# Altium schematic sheet HandHeld_Terminal_V2_Rev2.SchDoc
size A1; SheetNumber: 1; SheetTotal: 1
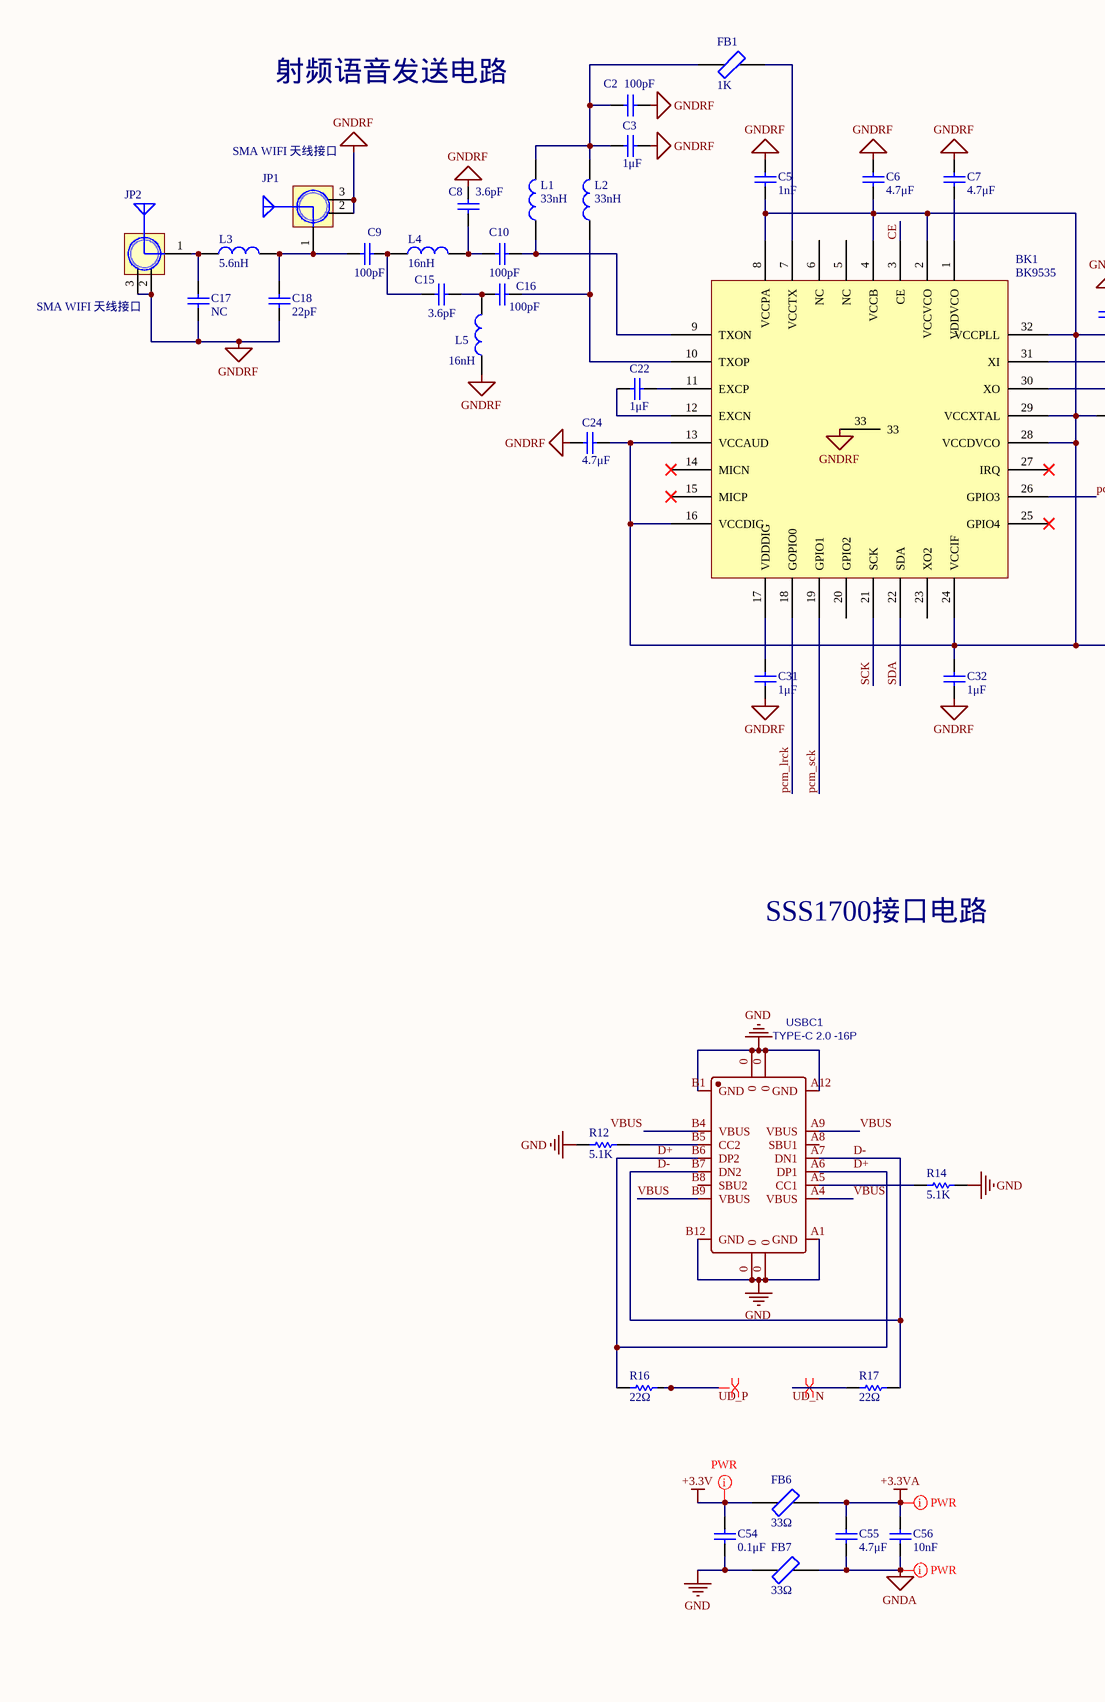
[diagram p0: HandHeld_Terminal_V2_Rev2.SchDoc, left]
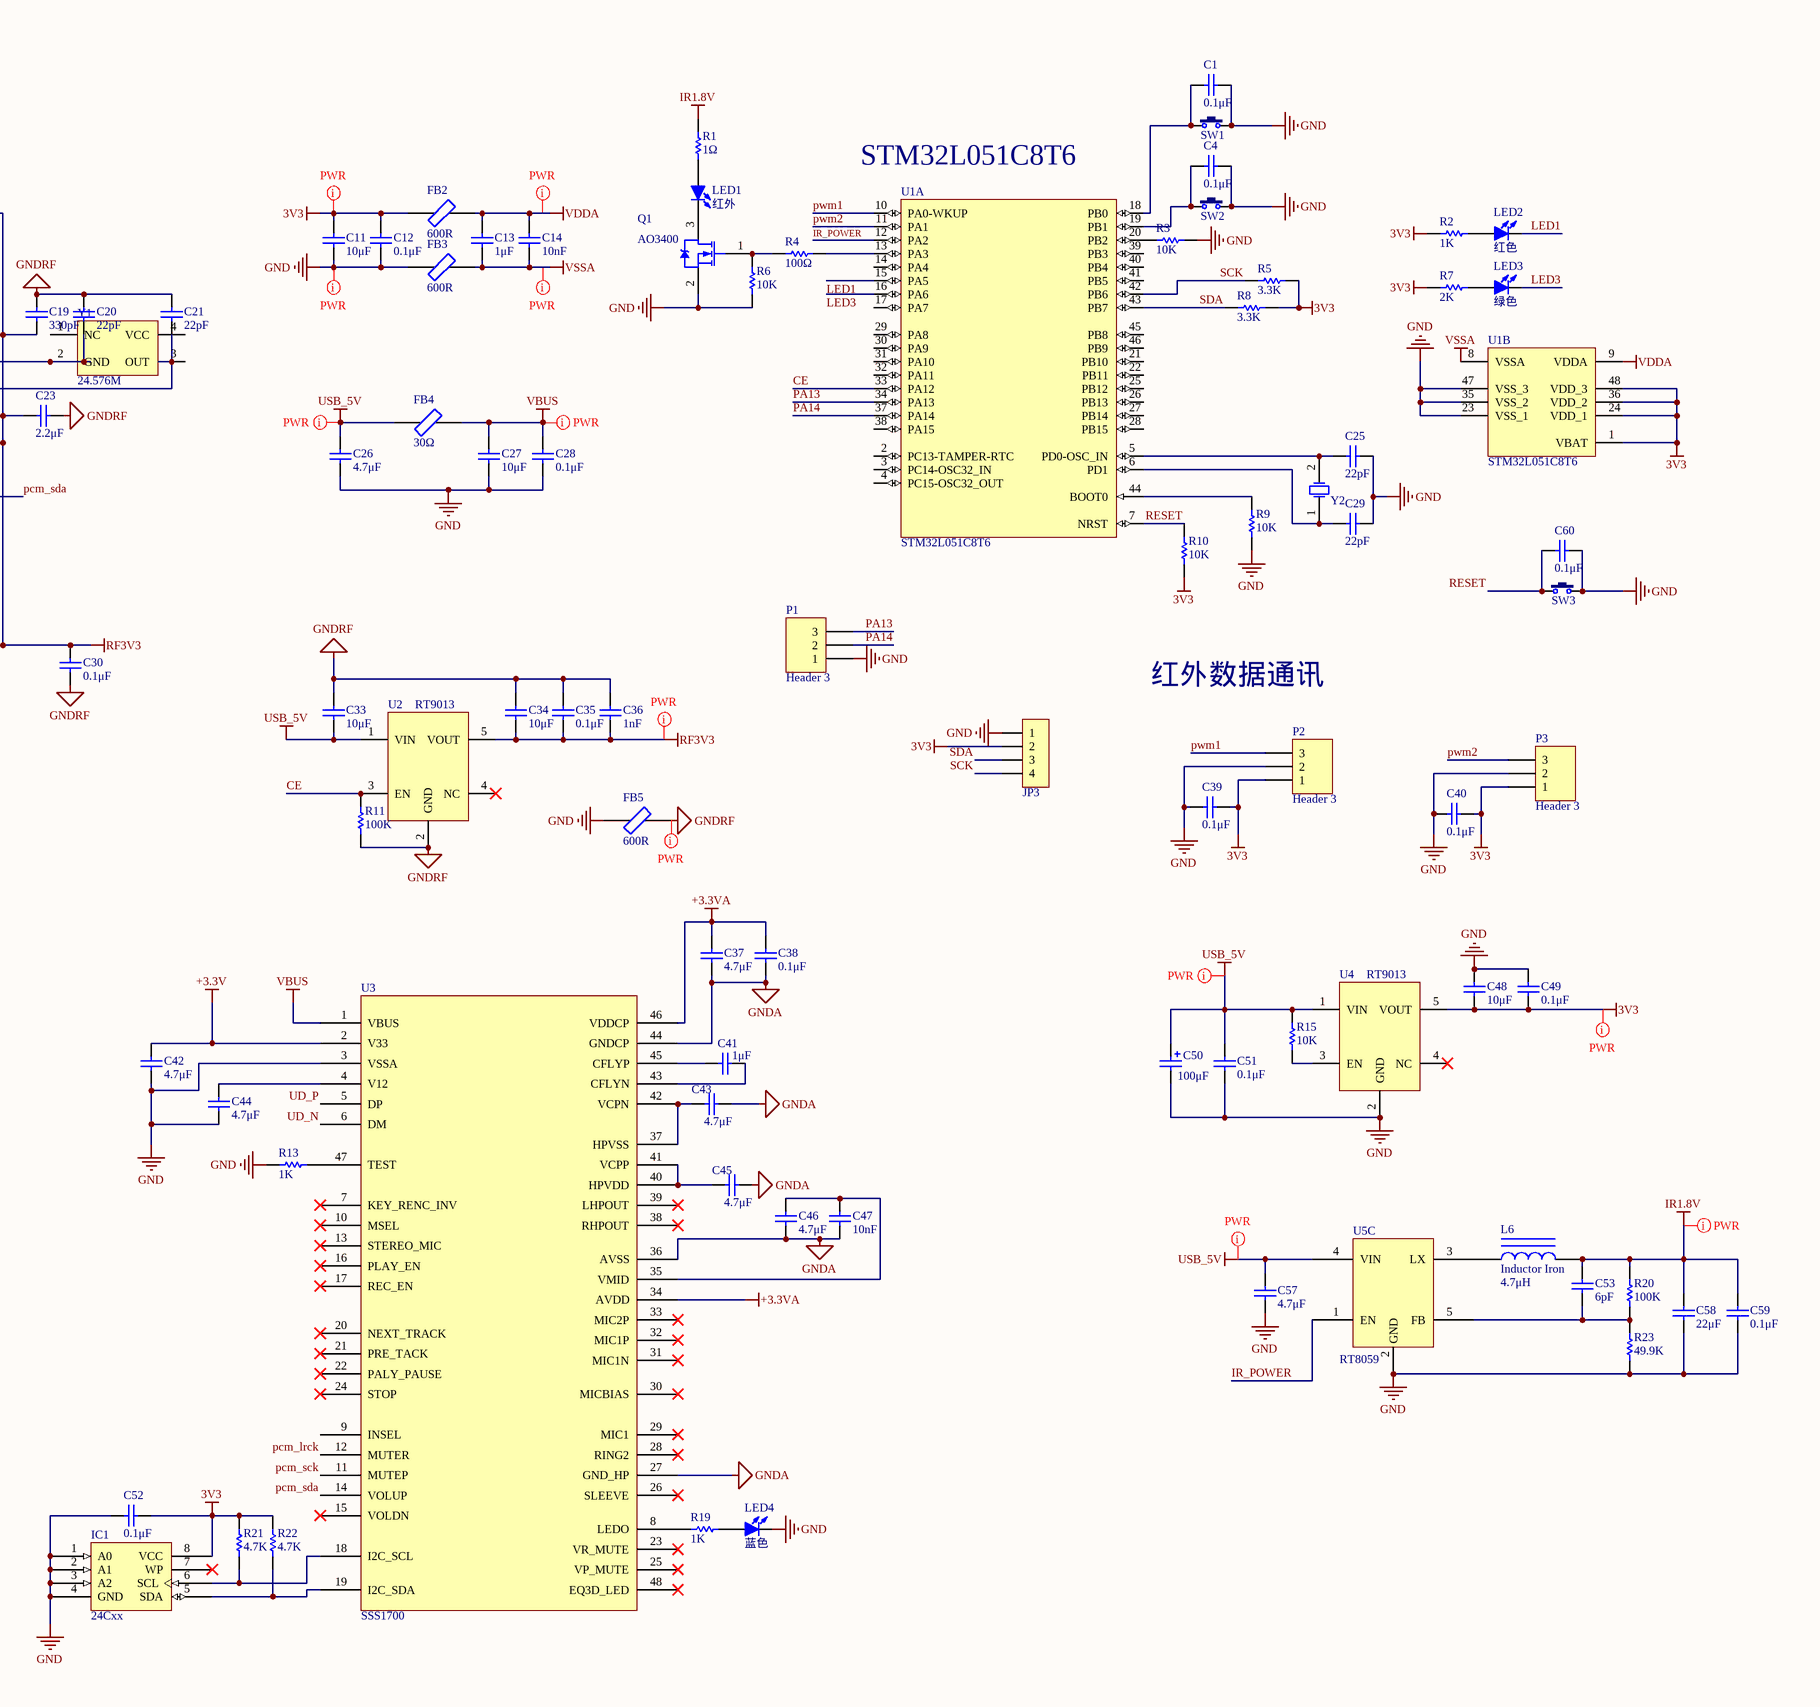
[diagram p1: HandHeld_Terminal_V2_Rev2.SchDoc, right]

## Parts
BK1  BK9535  [QFN32 5x5_N]
C1  value 0.1μF  [C 0603_L]  (hidden comment: Cap)
C2  value 100pF  [C 0603_L]  (hidden comment: Cap)
C3  value 1μF  [C 0603_L]  (hidden comment: Cap)
C4  value 0.1μF  [C 0603_L]  (hidden comment: Cap)
C5  value 1nF  [C 0603_L]  (hidden comment: Cap)
C6  value 4.7μF  [C 0603_L]  (hidden comment: Cap)
C7  value 4.7μF  [C 0603_L]  (hidden comment: Cap)
C8  value 3.6pF  [C 0603_L]  (hidden comment: Cap)
C9  value 100pF  [C 0603_L]  (hidden comment: Cap)
C10  value 100pF  [C 0603_L]  (hidden comment: Cap)
C11  value 10μF  [C 0805_L]  (hidden comment: Cap)
C12  value 0.1μF  [C 0603_L]  (hidden comment: Cap)
C13  value 1μF  [C 0603_L]  (hidden comment: Cap)
C14  value 10nF  [C 0603_L]  (hidden comment: Cap)
C15  value 3.6pF  [C 0603_L]  (hidden comment: Cap)
C16  value 100pF  [C 0603_L]  (hidden comment: Cap)
C17  value NC  [C 0603_L]  (hidden comment: Cap)
C18  value 22pF  [C 0603_L]  (hidden comment: Cap)
C19  value 330pF  [C 0603_L]  (hidden comment: Cap)
C20  value 22pF  [C 0603_L]  (hidden comment: Cap)
C21  value 22pF  [C 0603_L]  (hidden comment: Cap)
C22  value 1μF  [C 0603_L]  (hidden comment: Cap)
C23  value 2.2μF  [C 0603_L]  (hidden comment: Cap)
C24  value 4.7μF  [C 0603_L]  (hidden comment: Cap)
C25  value 22pF  [C 0603_L]  (hidden comment: Cap)
C26  value 4.7μF  [C 0805_L]  (hidden comment: Cap)
C27  value 10μF  [C 0805_L]  (hidden comment: Cap)
C28  value 0.1μF  [C 0603_L]  (hidden comment: Cap)
C29  value 22pF  [C 0603_L]  (hidden comment: Cap)
C30  value 0.1μF  [C 0603_L]  (hidden comment: Cap)
C31  value 1μF  [C 0603_L]  (hidden comment: Cap)
C32  value 1μF  [C 0603_L]  (hidden comment: Cap)
C33  value 10μF  [C 0805_L]  (hidden comment: Cap)
C34  value 10μF  [C 0805_L]  (hidden comment: Cap)
C35  value 0.1μF  [C 0603_L]  (hidden comment: Cap)
C36  value 1nF  [C 0603_L]  (hidden comment: Cap)
C37  value 4.7μF  [C 0603_L]  (hidden comment: Cap)
C38  value 0.1μF  [C 0603_L]  (hidden comment: Cap)
C39  value 0.1μF  [C 0603_L]  (hidden comment: Cap)
C40  value 0.1μF  [C 0603_L]  (hidden comment: Cap)
C41  value 1μF  [C 0603_L]  (hidden comment: Cap)
C42  value 4.7μF  [C 0603_L]  (hidden comment: Cap)
C43  value 4.7μF  [C 0603_L]  (hidden comment: Cap)
C44  value 4.7μF  [C 0603_L]  (hidden comment: Cap)
C45  value 4.7μF  [C 0603_L]  (hidden comment: Cap)
C46  value 4.7μF  [C 0603_L]  (hidden comment: Cap)
C47  value 10nF  [C 0603_L]  (hidden comment: Cap)
C48  value 10μF  [C 0805_L]  (hidden comment: Cap)
C49  value 0.1μF  [C 0603_L]  (hidden comment: Cap)
C50  value 100μF  [CM C(5*5.4)]  (hidden comment: Cap Pol1)
C51  value 0.1μF  [C 0603_L]  (hidden comment: Cap)
C52  value 0.1μF  [C 0603_L]  (hidden comment: Cap)
C53  value 6pF  [C 0603_L]  (hidden comment: Cap)
C54  value 0.1μF  [C 0603_L]  (hidden comment: Cap)
C55  value 4.7μF  [C 0805_L]  (hidden comment: Cap)
C56  value 10nF  [C 0603_L]  (hidden comment: Cap)
C57  value 4.7μF  [C 0603_L]  (hidden comment: Cap)
C58  value 22μF  [C 0805_L]  (hidden comment: Cap)
C59  value 0.1μF  [C 0603_L]  (hidden comment: Cap)
C60  value 0.1μF  [C 0603_L]  (hidden comment: Cap)
FB1  value 1K  [C 0603_L]  (hidden comment: Ferrite bead)
FB2  value 600R  [C 0603_L]  (hidden comment: Ferrite bead)
FB3  value 600R  [C 0603_L]  (hidden comment: Ferrite bead)
FB4  value 30Ω  [C 0603_L]  (hidden comment: Ferrite bead)
FB5  value 600R  [C 0805_L]  (hidden comment: Ferrite bead)
FB6  value 33Ω  [C 0603_L]  (hidden comment: Ferrite bead)
FB7  value 33Ω  [C 0603_L]  (hidden comment: Ferrite bead)
IC1  24Cxx  [SOP8_L]
JP1  SMA WIFI 天线接口  [COAXIAL/SMD/CON/V/I-PEX/W08-5801]
JP2  SMA WIFI 天线接口  [SMA-KE]
JP3  HDR-1X4  [HDR2.54-LI-4P]  (value not drawn)
L1  value 33nH  [L 0603]  (hidden comment: L)
L2  value 33nH  [L 0603]  (hidden comment: L)
L3  value 5.6nH  [L 0603]  (hidden comment: L)
L4  value 16nH  [L 0603]  (hidden comment: L)
L5  value 16nH  [L 0603]  (hidden comment: L)
L6  Inductor Iron  value 4.7μH  [NR2520]
LED1  红外  [LED 1W/3W]
LED2  红色  [LED 0805R]
LED3  绿色  [LED 0805G]
LED4  蓝色  [LED 0805B]
P1  Header 3  [HDR2.54-LI-3P]
P2  Header 3  [HDR1X3]
P3  Header 3  [HDR1X3]
Q1  AO3400  [SOT-23-3L]
R1  value 1Ω  [R 0805_L]  (hidden comment: Resistor)
R2  value 1K  [R 0603_L]  (hidden comment: Resistor)
R3  value 10K  [R 0603_L]  (hidden comment: Resistor)
R4  value 100Ω  [R 0603_L]  (hidden comment: Resistor)
R5  value 3.3K  [R 0603_L]  (hidden comment: Resistor)
R6  value 10K  [R 0603_L]  (hidden comment: Resistor)
R7  value 2K  [R 0603_L]  (hidden comment: Resistor)
R8  value 3.3K  [R 0603_L]  (hidden comment: Resistor)
R9  value 10K  [R 0603_L]  (hidden comment: Resistor)
R10  value 10K  [R 0603_L]  (hidden comment: Resistor)
R11  value 100K  [R 0603_L]  (hidden comment: Resistor)
R12  value 5.1K  [R 0603_L]  (hidden comment: Resistor)
R13  value 1K  [R 0603_L]  (hidden comment: Resistor)
R14  value 5.1K  [R 0603_L]  (hidden comment: Resistor)
R15  value 10K  [R 0603_L]  (hidden comment: Resistor)
R16  value 22Ω  [R 0603_L]  (hidden comment: Resistor)
R17  value 22Ω  [R 0603_L]  (hidden comment: Resistor)
R19  value 1K  [R 0603_L]  (hidden comment: Resistor)
R20  value 100K  [R 0603_L]  (hidden comment: Resistor)
R21  value 4.7K  [R 0603_L]  (hidden comment: Resistor)
R22  value 4.7K  [R 0603_L]  (hidden comment: Resistor)
R23  value 49.9K  [R 0603_L]  (hidden comment: Resistor)
SW1  3x6x5  [TSW SMD-3*6*2.5]  (value not drawn)
SW2  3x6x5  [TSW SMD-3*6*2.5]  (value not drawn)
SW3  3x6x5  [TSW SMD-3*6*2.5]  (value not drawn)
U1  STM32L051C8T6  [LQFP48_L]  (parts A,B of 2)
U2  RT9013  [SOT23-5L]
U3  SSS1700  [LQFP48_L]
U4  RT9013  [SOT23-5L]
U5  RT8059  [SOT23-5L]  (part C of 3)
USBC1  TYPE-C 2.0 -16P  [USB-C-SMD_TYPE-C-USB-5]
Y1  24.576M  [OSC 3225-4P]
Y2  8MHz ±20ppm 20pF  [OSC 5032-2P]  (value not drawn)

## Nets
3V3: C11.2 C12.2 C39.1 C40.1 C48.1 C49.2 C52.1 FB2.1 IC1.8(VCC) JP3.2 P2.1 P3.1 R2.2 R5.1 R7.2 R8.1 R10.2 R21.2 R22.2 U1.1(VBAT) U1.24(VDD_1) U1.36(VDD_2) U1.48(VDD_3) U4.5(VOUT)
+3.3V: C42.2 C54.2 FB6.1 U3.2(V33)
+3.3VA: C37.2 C38.2 C55.2 C56.2 FB6.2 U3.34(AVDD) U3.46(VDDCP)
GND: C1.1 C4.1 C11.1 C12.1 C25.1 C26.1 C27.1 C28.1 C29.1 C39.2 C40.2 C42.1 C44.1 C48.2 C49.1 C50.2 C51.2 C52.2 C54.1 C57.2 C58.2 C59.2 C60.1 FB3.1 FB5.1 FB7.1 IC1.1(A0) IC1.2(A1) IC1.3(A2) IC1.4(GND) JP3.1 LED4.2(K) P1.1 P2.2 P3.2 Q1.2(S) R3.2 R6.1 R9.2 R12.2 R13.2 R14.1 R23.1 SW1.2 SW2.2 SW3.2 U1.23(VSS_1) U1.35(VSS_2) U1.47(VSS_3) U3.3(VSSA) U4.2(GND) U5.2(GND) USBC1.0 USBC1.A1(GND) USBC1.A12(GND) USBC1.B1(GND) USBC1.B12(GND)
GNDA: C37.1 C38.1 C43.1 C45.1 C46.1 C47.1 C55.1 C56.1 FB7.2 U3.27(GND_HP) U3.36(AVSS) U3.44(GNDCP)
GNDRF: BK1.33 C2.1 C3.1 C5.1 C6.1 C7.1 C8.1 C17.2 C18.2 C19.2 C20.2 C21.2 C23.1 C24.2 C30.1 C31.1 C32.1 C33.2 C34.2 C35.2 C36.1 FB5.2 JP1.2(GND) JP1.3(GND) JP2.2(GND) JP2.3(GND) L5.1 R11.1 U2.2(GND)
IR1.8V: C53.1 C58.1 C59.1 L6.2 R1.2 R20.2
RF3V3: BK1.2(VCCVCO) BK1.4(VCCB) BK1.8(VCCPA) BK1.13(VCCAUD) BK1.16(VCCDIG) BK1.24(VCCIF) BK1.28(VCCDVCO) BK1.29(VCCXTAL) BK1.32(VCCPLL) C5.2 C6.2 C19.1 C23.2 C24.1 C30.2 C32.2 C34.1 C35.1 C36.2 U2.5(VOUT)
USB_5V: C26.2 C33.1 C50.1 C51.1 C57.1 FB4.1 R15.2 U2.1(VIN) U4.1(VIN) U5.4(VIN)
VBUS: C27.2 C28.2 FB4.2 U3.1(VBUS) USBC1.A4(VBUS) USBC1.A9(VBUS) USBC1.B4(VBUS) USBC1.B9(VBUS)
VDDA: C13.2 C14.2 FB2.2 U1.9(VDDA)
VSSA: C13.1 C14.1 FB3.2 U1.8(VSSA)
CE: BK1.3(CE) R11.2 U1.33(PA12) U2.3(EN)
D+: R16.1 USBC1.A6(DP1) USBC1.B6(DP2)
D-: R17.2 USBC1.A7(DN1) USBC1.B7(DN2)
IR_POWER: U1.12(PA2) U5.1(EN)
LED1: LED2.2(K) U1.15(PA5)
LED3: LED3.2(K) U1.16(PA6)
PA13: P1.3 U1.34(PA13)
PA14: P1.2 U1.37(PA14)
pcm_lrck: BK1.18(GOPIO0) U3.12(MUTER)
pcm_sck: BK1.19(GPIO1) U3.11(MUTEP)
pcm_sda: BK1.26(GPIO3) U3.14(VOLUP)
pwm1: P2.3 U1.10(PA0-WKUP)
pwm2: P3.3 U1.11(PA1)
RESET: C60.2 R10.1 SW3.1 U1.7(NRST)
SCK: BK1.21(SCK) JP3.4 R5.2 U1.42(PB6)
SDA: BK1.22(SDA) JP3.3 R8.2 U1.43(PB7)
UD_N: R17.1 U3.6(DM)
UD_P: R16.2 U3.5(DP)
NetBK1_1: BK1.1(VDDVCO) C7.2
NetBK1_7: BK1.7(VCCTX) FB1.2
NetBK1_9: BK1.9(TXON) C10.1 L1.1
NetBK1_10: BK1.10(TXOP) C16.1 L2.1
NetBK1_11: BK1.11(EXCP) C22.1
NetBK1_12: BK1.12(EXCN) C22.2
NetBK1_17: BK1.17(VDDDIG) C31.2
NetBK1_30: BK1.30(XO) C21.1
NetBK1_31: BK1.31(XI) C20.1 Y1.2(GND)
NetC1_2: C1.2 SW1.1 U1.18(PB0)
NetC2_2: C2.2 C3.2 FB1.1 L1.2 L2.2
NetC4_2: C4.2 SW2.1 U1.19(PB1)
NetC8_2: C8.2 C10.2 L4.2
NetC9_1: C9.1 C15.2 L4.1
NetC9_2: C9.2 C18.1 JP1.1(ANT) L3.2
NetC15_1: C15.1 C16.2 L5.2
NetC17_1: C17.1 JP2.1(ANT) L3.1
NetC25_2: C25.2 U1.5(PD0-OSC_IN) Y2.2(OSC2)
NetC29_2: C29.2 U1.6(PD1) Y2.1(OSC1)
NetC41_1: C41.1 U3.43(CFLYN)
NetC41_2: C41.2 U3.45(CFLYP)
NetC43_2: C43.2 U3.37(HPVSS) U3.42(VCPN)
NetC44_2: C44.2 U3.4(V12)
NetC45_2: C45.2 U3.40(HPVDD) U3.41(VCPP)
NetC46_2: C46.2 C47.2 U3.35(VMID)
NetC53_2: C53.2 R20.1 R23.2 U5.5(FB)
NetIC1_5: IC1.5(SDA) R22.1 U3.19(I2C_SDA)
NetIC1_6: IC1.6(SCL) R21.1 U3.18(I2C_SCL)
NetL6_1: L6.1 U5.3(LX)
NetLED1_1: LED1.1(A) R1.1
NetLED1_2: LED1.2(K) Q1.3(D)
NetLED2_1: LED2.1(A) R2.1
NetLED3_1: LED3.1(A) R7.1
NetLED4_1: LED4.1(A) R19.1
NetQ1_1: Q1.1(G) R4.1 R6.2
NetR3_1: R3.1 U1.20(PB2)
NetR4_2: R4.2 U1.13(PA3)
NetR9_1: R9.1 U1.44(BOOT0)
NetR12_1: R12.1 USBC1.B5(CC2)
NetR13_1: R13.1 U3.47(TEST)
NetR14_2: R14.2 USBC1.A5(CC1)
NetR15_1: R15.1 U4.3(EN)
NetR19_2: R19.2 U3.8(LEDO)

Not connected (* = marked no-connect by the designer): BK1 5(NC) 6(NC) 14(MICN)* 15(MICP)* 20(GPIO2) 23(XO2) 25(GPIO4)* 27(IRQ)*; IC1 7(WP)*; U1 2(PC13-TAMPER-RTC) 3(PC14-OSC32_IN) 4(PC15-OSC32_OUT) 14(PA4) 17(PA7) 21(PB10) 22(PB11) 25(PB12) 26(PB13) 27(PB14) 28(PB15) 29(PA8) 30(PA9) 31(PA10) 32(PA11) 38(PA15) 39(PB3) 40(PB4) 41(PB5) 45(PB8) 46(PB9); U2 4(NC)*; U3 7(KEY_RENC_INV)* 9(INSEL) 10(MSEL)* 13(STEREO_MIC)* 15(VOLDN)* 16(PLAY_EN)* 17(REC_EN)* 20(NEXT_TRACK)* 21(PRE_TACK)* 22(PALY_PAUSE)* 23(VR_MUTE)* 24(STOP)* 25(VP_MUTE)* 26(SLEEVE)* 28(RING2)* 29(MIC1)* 30(MICBIAS)* 31(MIC1N)* 32(MIC1P)* 33(MIC2P)* 38(RHPOUT)* 39(LHPOUT)* 48(EQ3D_LED)*; U4 4(NC)*; USBC1 A8(SBU1) B8(SBU2); Y1 1(NC) 3(OUT) 4(VCC)

## Layout directives
net class PWR: 3V3, +3.3V, +3.3VA, GND, GNDA, GNDRF, IR1.8V, RF3V3, USB_5V, VBUS, VDDA, VSSA
differential pair: UD_N, UD_P

## Notes on the sheet
- 射频语音发送电路
- (near U1) STM32L051C8T6
- 红外数据通讯
- SSS1700接口电路

## Library data of the parts
BK1 = BK9530
C1-C49 C51-C60 = Cap: Capacitor; Published: 8-Jun-2000; LatestRevisionDate: 17-Jul-2002; LatestRevisionNote: Re-released for DXP Platform.; PackageReference: RAD-0.3; Publisher: Altium Limited; PackageDescription: Radial Cap, Thru-Hole; 2 Leads; 0.3 in Pin Spacing
C50 = Cap Pol1: Polarized Capacitor (Radial); Published: 8-Jun-2000; LatestRevisionDate: 17-Jul-2002; LatestRevisionNote: Re-released for DXP Platform.; PackageReference: RB7.6-15; Publisher: Altium Limited
FB1-FB7 = Ferrite bead: 铁氧体磁珠
IC1 = 24Cxx: 外置EEPROM; 版权归属: 封装库来自淘宝 ID：黄晶宝石; BOM名称: 外置EEPROM; 唯一出售店铺网址: https://shop463601444.taobao.com
JP1 JP2 = SMA: SMA-2.4G射频天线接口; 版权归属: 封装库来自淘宝 ID：黄晶宝石; BOM名称: SMA-2.4G射频天线接口; 唯一出售店铺网址: https://shop463601444.taobao.com
JP3 = Header 4: 4P接插件; 版权归属: 封装库来自淘宝 ID：黄晶宝石; BOM名称: 4P接插件; 学习资源: https://shop463601444.taobao.com
L1-L5 = L: 小功率贴片电感; 淘宝ID: 封装库来自淘宝 ID：黄晶宝石; 封装库来自淘宝卖家 ID：黄晶宝石: 其他店铺购入均为盗版，不享受售后技术支持服务，请立即申请退款; BOM名称: 小功率贴片电感; 联系售后: https://shop463601444.taobao.com
L6 = Inductor Iron: Magnetic-Core Inductor; Published: 24-Mar-1999; LatestRevisionDate: 17-Jul-2002; LatestRevisionNote: Re-released for DXP Platform.; PackageReference: AXIAL-0.9; Publisher: Altium Limited; PackageDescription: Axial Device, Thru-Hole; 2 Leads; 0.9 in Pin Spacing
LED1-LED4 = LED-SMD: 贴片LED; 版权归属: 封装库来自淘宝 ID：黄晶宝石; BOM名称: 贴片LED; 学习资源: https://shop463601444.taobao.com
P1-P3 = Header 3: Header, 3-Pin; LatestRevisionDate: 17-Jul-2002; LatestRevisionNote: Re-released for DXP Platform.; Publisher: Altium Limited
Q1 = NMOS-2: N-Channel Power MOSFET; Note: Pin 2 is electrically connected to pin 4.; Published: 8-Jun-2000; LatestRevisionDate: 17-Jul-2002; LatestRevisionNote: Re-released for DXP Platform.; DatasheetVersion: PD-9.814; PackageVersion: Feb-1997; PackageReference: TO-220AB; Publisher: Altium Limited; PackageDescription: TO, Thru-Hole, Vertical, Heatsink Mounted; 3 In-Line Leads; Pitch 2.54 mm; ComponentLink1Description: Manufacturer Link; ComponentLink1URL: http://www.irf.com/
SW1-SW3 = TSW 3x6: 3x6轻触开关; 版权归属: 封装库来自淘宝 ID：黄晶宝石; BOM名称: 3x6轻触开关; 学习资源: https://shop463601444.taobao.com
U1 = STM32F103C8T6: ARM; ComponentLink1Description: 供应商链接; ComponentLink1URL: http://www.szlcsc.com/product/details_9243.html; Package: LQFP-48_7x7x05P; Supplier: LC; SuppliersPartNumber: C8734
U2 U4 = RT9013: LDO
U3 = SSS1700: USB音频芯片
U5 = RT8059: DC-DC, 2.8-5.5V,1A
USBC1 = USB2.0 Type-C 16Pin母座: USB2.0 Type-C 母座 16Pin; BOM_Manufacturer: LCSC; BOM_Supplier: LCSC; BOM_Manufacturer Part: -; spicePre: U; spiceSymbolName: TYPE-C 3.1 -16P_C168689
Y1 = XTAL: 4脚有源晶振
Y2 = SMD-5032_2P 8MHz 20ppm 20pF: 贴片晶振; ComponentLink1Description: 供应商链接; ComponentLink1URL: http://www.szlcsc.com/product/details_117214.html; Package: SMD-5032_2P; Supplier: LC; SuppliersPartNumber: C115962
R1-R17 R19-R23 = Resistor: Published: 8-Jun-2000; LatestRevisionDate: 17-Jul-2002; LatestRevisionNote: Re-released for DXP Platform.; PackageReference: AXIAL-0.5; Publisher: Altium Limited